# Altium schematic sheet interface.SchDoc
size 209 x 297 mm
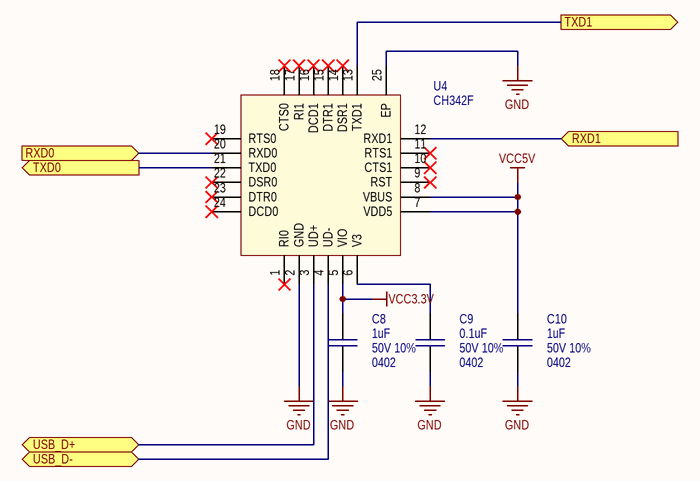
[diagram p0: interface.SchDoc]

## Parts
C8  value 1uF  Case/Package: 0402  Tolerance: 50V 10%  [C_0402]  (hidden comment: C0402)
C9  value 0.1uF  Case/Package: 0402  Tolerance: 50V 10%  [C_0402]  (hidden comment: C0402)
C10  value 1uF  Case/Package: 0402  Tolerance: 50V 10%  [C_0402]  (hidden comment: C0402)
U4  CH342F  [QFN50P400X400X80-25N-D]

## Ports
RXD0 (in), RXD1 (in), TXD0 (out), TXD1 (out), USB_D+ (bidir), USB_D- (bidir)

## Nets
GND: C8.1 C9.1 C10.1 U4.2(GND) U4.25(EP)
VCC3.3V: C8.2 U4.5(VIO)
VCC5V: C10.2 U4.7(VDD5) U4.8(VBUS)
RXD0: U4.20(RXD0) ; port RXD0
RXD1: U4.12(RXD1) ; port RXD1
TXD0: U4.21(TXD0) ; port TXD0
TXD1: U4.13(TXD1) ; port TXD1
USB_D+: U4.3(UD+) ; port USB_D+
USB_D-: U4.4(UD-) ; port USB_D-
NetC9_2: C9.2 U4.6(V3)

Not connected (* = marked no-connect by the designer): U4 1(RI0)* 9(RST)* 10(CTS1)* 11(RTS1)* 14(DSR1)* 15(DTR1)* 16(DCD1)* 17(RI1)* 18(CTS0)* 19(RTS0)* 22(DSR0)* 23(DTR0)* 24(DCD0)*

## Library data of the parts
C8 C10 = C0402: Capacitor; Part: CC0402KRX5R9BB105; Alternative Part: *
C9 = C0402: Capacitor; Part: CC0402KRX5R9BB104; Alternative Part: *
U4 = CH342F: Part: CH342F